# EAGLE schematic Band (EAGLE 9.1.0)
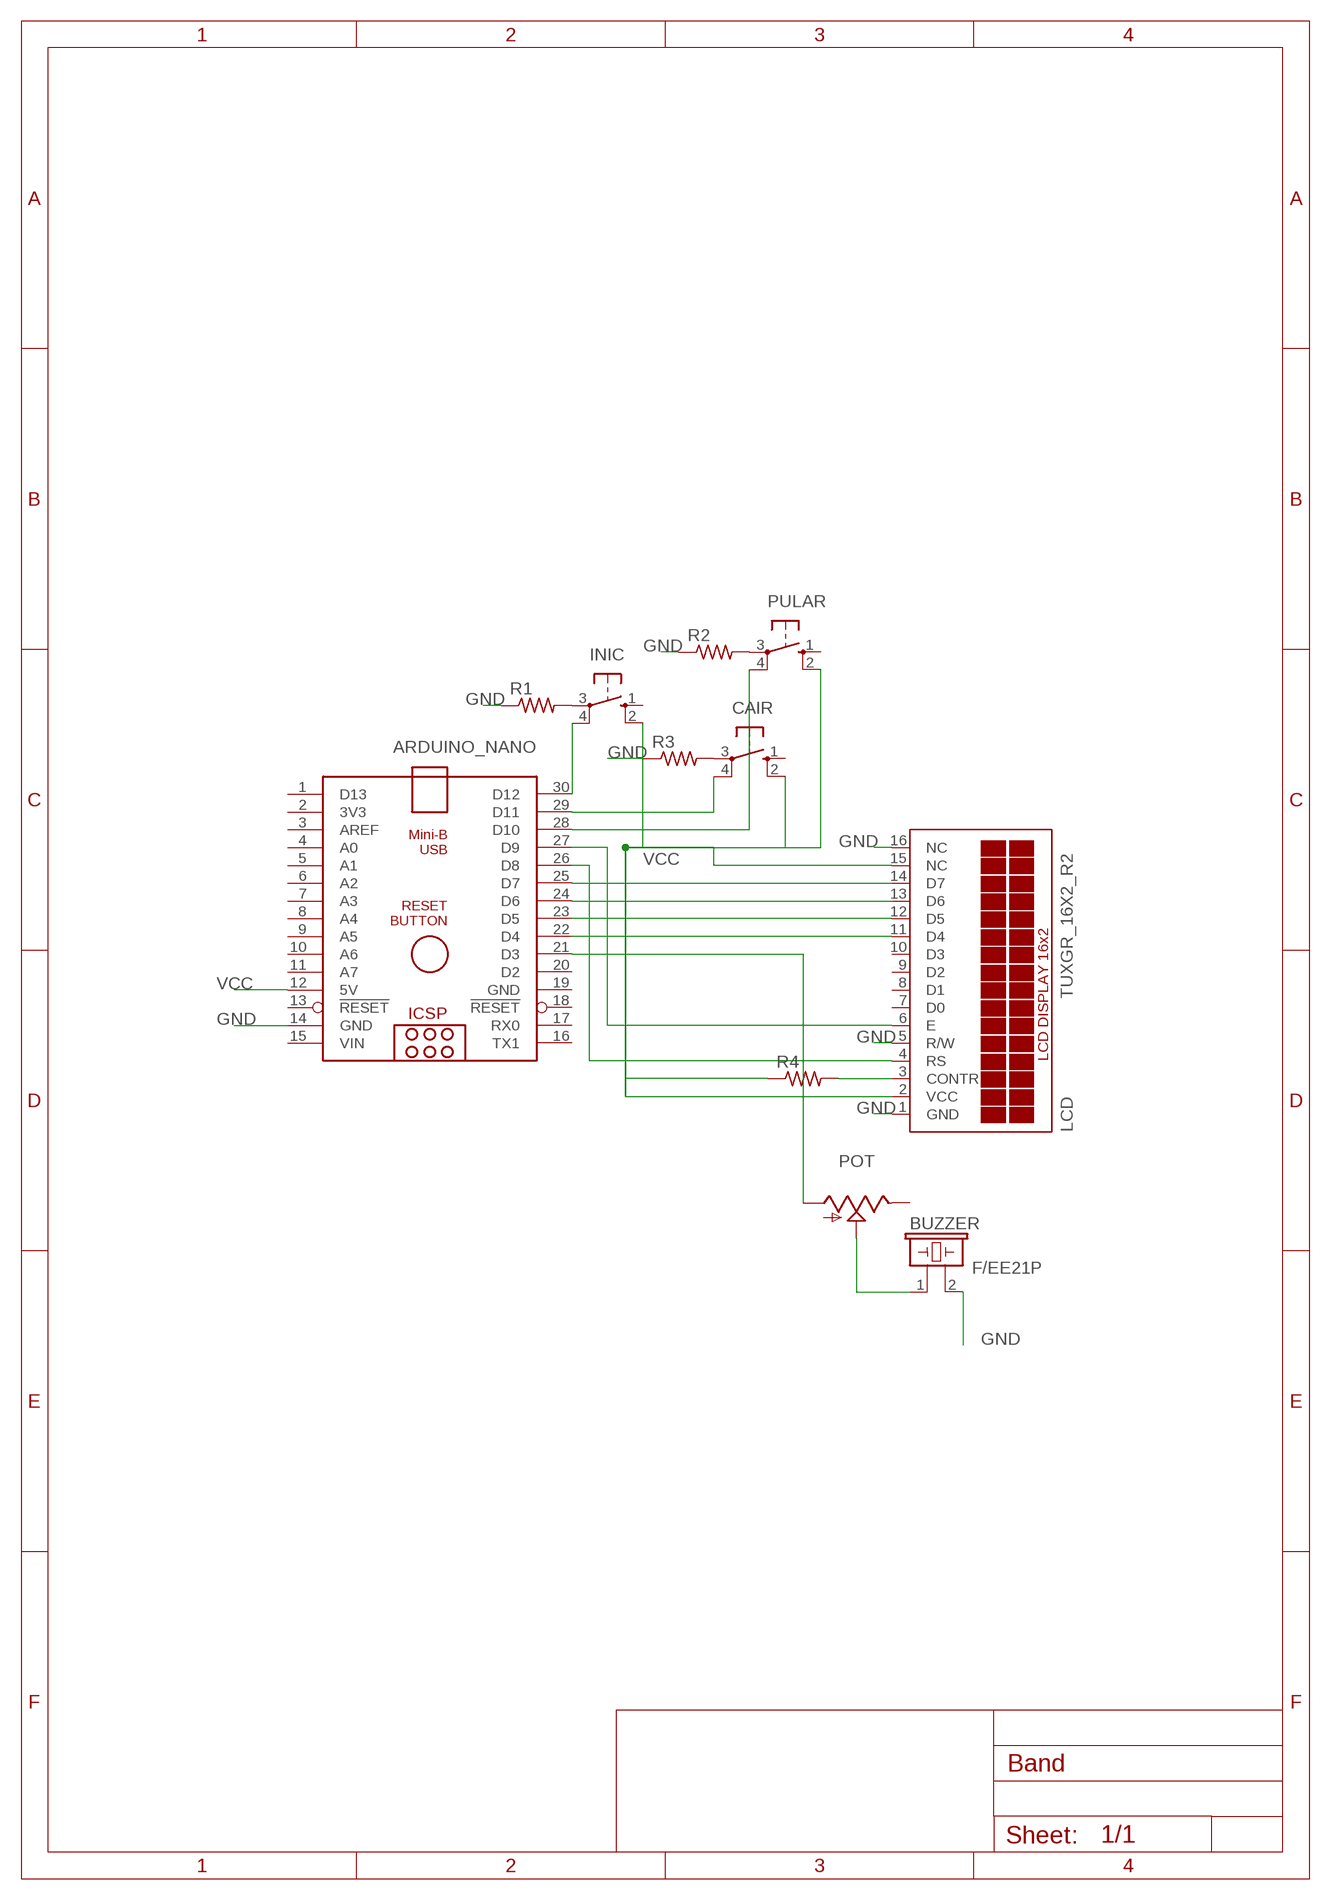
[diagram p0: schematic, sheet 1]

## Parts
ARDUINO_NANO  ARDUINO_NANO  [ARDUINO_NANO]
BUZZER  F/EE21P  [F/EE21P]
CAIR  10-XX  [B3F-10XX]
INIC  10-XX  [B3F-10XX]
LCD  TUXGR_16X2_R2  [TUXGR_16X2_R2]
POT  TRIM_US-CIP20C-6MM  [CIP20C-6MM]
PULAR  10-XX  [B3F-10XX]
R1  R-US_0204/7  [0204/7]
R2  R-US_0204/7  [0204/7]
R3  R-US_0204/7  [0204/7]
R4  R-US_0204/7  [0204/7]

## Nets
GND: ARDUINO_NANO.14(GND) BUZZER.2 LCD.1(GND) LCD.5(R/W) LCD.16(NC) R1.1 R2.1 R3.1
N$1: ARDUINO_NANO.25(D7) LCD.14(D7)
N$2: ARDUINO_NANO.30(D12) INIC.4(P1)
N$3: ARDUINO_NANO.29(D11) CAIR.4(P1)
N$4: ARDUINO_NANO.28(D10) PULAR.4(P1)
N$5: PULAR.3(P) R2.2
N$6: INIC.3(P) R1.2
N$7: CAIR.3(P) R3.2
N$8: ARDUINO_NANO.24(D6) LCD.13(D6)
N$9: ARDUINO_NANO.23(D5) LCD.12(D5)
N$10: ARDUINO_NANO.22(D4) LCD.11(D4)
N$11: ARDUINO_NANO.26(D8) LCD.4(RS)
N$12: ARDUINO_NANO.27(D9) LCD.6(E)
N$13: LCD.3(CONTR) R4.2
N$14: ARDUINO_NANO.21(D3) POT.A
N$15: BUZZER.1 POT.S
VCC: ARDUINO_NANO.12(5V) CAIR.2(S1) INIC.2(S1) LCD.2(VCC) LCD.15(NC) PULAR.2(S1) R4.1
Unconnected: ARDUINO_NANO.1(D13) ARDUINO_NANO.2(3V3) ARDUINO_NANO.3(AREF) ARDUINO_NANO.4(A0) ARDUINO_NANO.5(A1) ARDUINO_NANO.6(A2) ARDUINO_NANO.7(A3) ARDUINO_NANO.8(A4) ARDUINO_NANO.9(A5) ARDUINO_NANO.10(A6) ARDUINO_NANO.11(A7) ARDUINO_NANO.13(!RESET) ARDUINO_NANO.16(TX1) ARDUINO_NANO.17(RX0) ARDUINO_NANO.18(!RESET) ARDUINO_NANO.20(D2) CAIR.1(S) INIC.1(S) LCD.7(D0) LCD.8(D1) LCD.9(D2) LCD.10(D3) POT.E PULAR.1(S)

## Power pins joined to a net without a drawn wire
GND: ARDUINO_NANO.19(GND)
VIN: ARDUINO_NANO.15(VIN)

## Library data of the parts
ARDUINO_NANO = ArduinoNanoV30:ARDUINO_NANO: Arduino Nano V3.0 Overview: The Arduino Nano is a small, complete, and breadboard-friendly board based on the ATmega328 (Arduino Nano 3.x) or ATmega168 (Arduino Nano 2.x). It has more or less the same functionality of the Arduino Duemilanove, but in a different package. It lacks only a DC power jack, and works with a Mini-B USB cable instead of a standard one. The Nano was designed and is being produced by Gravitech. Specifications: Microcontroller Atmel ATmega168 or ATmega328 Operating Voltage (logic level) 5 V Input Voltage (recommended) 7-12 V Input Voltage (limits) 6-20 V Digital I/O Pins 14 (of which 6 provide PWM output) Analog Input Pins 8 DC Current per I/O Pin 40 mA Flash Memory 16 KB (ATmega168) or 32 KB (ATmega328) of which 2 KB used by bootloader SRAM 1 KB (ATmega168) or 2 KB (ATmega328) EEPROM 512 bytes (ATmega168) or 1 KB (ATmega328) Clock Speed 16 MHz Dimensions 0.73" x 1.70" Length 45 mm Width 18 mm Weigth 5 g Power: The Arduino Nano can be powered via the Mini-B USB connection, 6-20V unregulated external power supply (pin 30), or 5V regulated external power supply (pin 27). The power source is automatically selected to the highest voltage source. Memory: The ATmega168 has 16 KB of flash memory for storing code (of which 2 KB is used for the bootloader); the ATmega328 has 32 KB, (also with 2 KB used for the bootloader). The ATmega168 has 1 KB of SRAM and 512 bytes of EEPROM (which can be read and written with the EEPROM library); the ATmega328 has 2 KB of SRAM and 1 KB of EEPROM. Input and Output: Each of the 14 digital pins on the Nano can be used as an input or output, using pinMode(), digitalWrite(), and digitalRead() functions. They operate at 5 volts. Each pin can provide or receive a maximum of 40 mA and has an internal pull-up resistor (disconnected by default) of 20-50 kOhms. In addition, some pins have specialized functions. Visit Arduino - ArduinoBoardNano <https://www.arduino.cc/en/Main/ArduinoBoardNano>
BUZZER = buzzer:F/EE21P: BUZZER Source: Buerklin; OC_FARNELL: unknown; OC_NEWARK: unknown
CAIR INIC PULAR = switch-omron:10-XX: OMRON SWITCH; MPN: B3F-1000; OC_FARNELL: 176432; OC_NEWARK: 36M3542
LCD = display-lcd:TUXGR_16X2_R2: Tuxgraphics LCD display 16x2 characters reflective, without background light Source: tuxgr_12x2_r2.pdf; OC_FARNELL: unknown; OC_NEWARK: unknown
POT = pot:TRIM_US-: POTENTIOMETER
R1-R4 = rcl:R-US_: RESISTOR, American symbol; SPICEPREFIX: R